# EAGLE design krajBB-Mojžiš_MatejFIN2 (EAGLE 7.7.0)
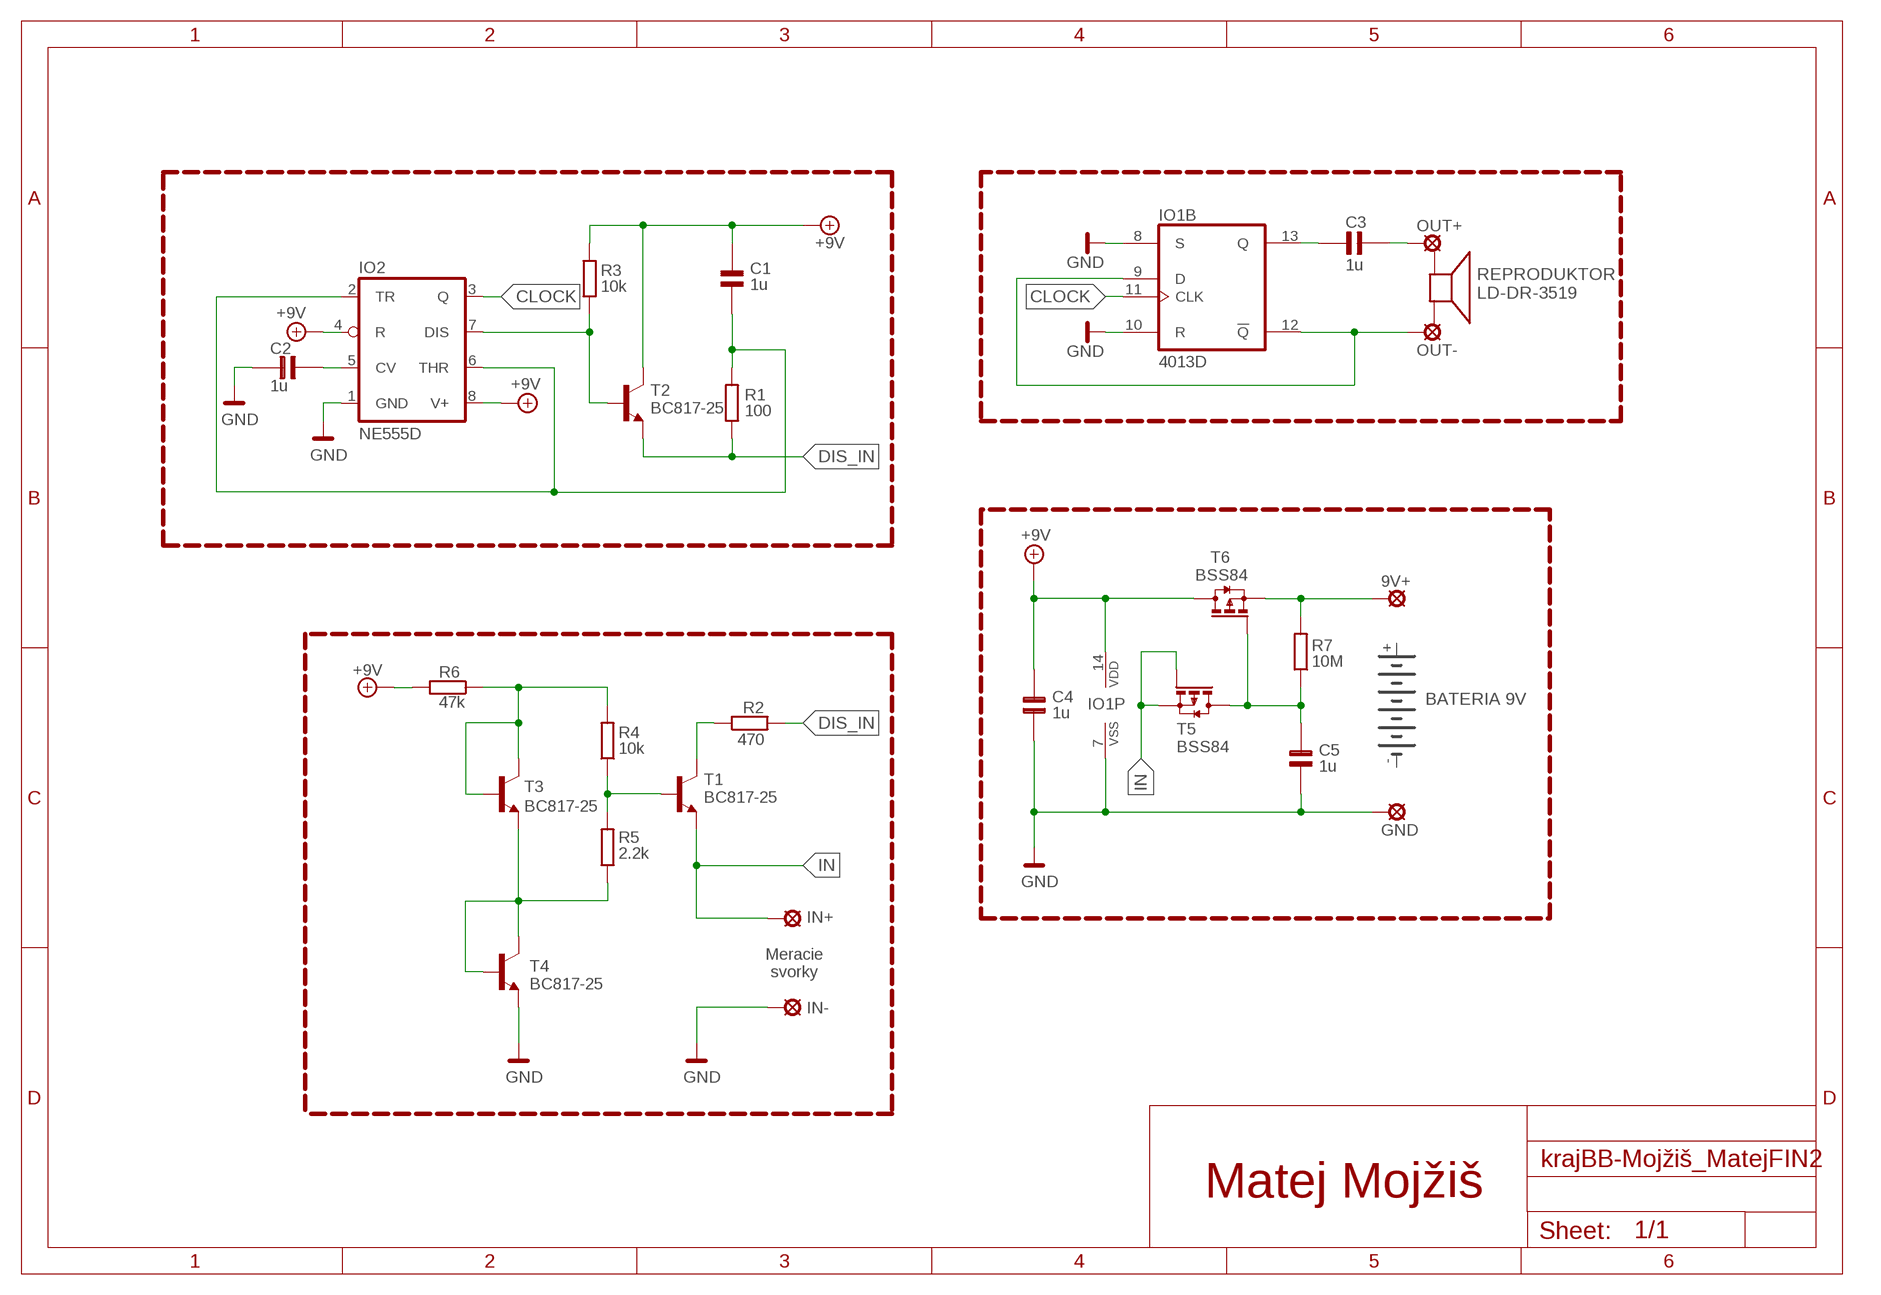
[diagram p0: schematic, sheet 1]

## Parts
9V+  SMD3X3  [SMD3X3]
C1  1u  C1206TOP  [1206]
C2  1u  C1206TOP  [1206]
C3  1u  C1206TOP  [1206]
C4  1u  C1206TOP  [1206]
C5  1u  C1206TOP  [1206]
GND  SMD3X3  [SMD3X3]
IN+  SMD3X3  [SMD3X3]
IN-  SMD3X3  [SMD3X3]
IO1  4013D  [SO14]
IO2  NE555D  [SO08]
OUT+  SMD3X3  [SMD3X3]
OUT-  SMD3X3  [SMD3X3]
R1  100  R1206TOP  [1206]
R2  470  R1206TOP  [1206]
R3  10k  R1206TOP  [1206]
R4  10k  R1206TOP  [1206]
R5  2.2k  R1206TOP  [1206]
R6  47k  R1206TOP  [1206]
R7  10M  R1206TOP  [1206]
REPRODUKTOR  LD-DR-3519  [LD-DR-3519]
T1  BC817-25  BC817-25SMD  [SOT23-BEC]
T2  BC817-25  BC817-25SMD  [SOT23-BEC]
T3  BC817-25  BC817-25SMD  [SOT23-BEC]
T4  BC817-25  BC817-25SMD  [SOT23-BEC]
T5  BSS84  [SOT23]
T6  BSS84  [SOT23]
U$1  9VBATTERY  [9VBATTERY]

## Nets
9V_1: R4.2 R6.1 T3.B T3.C
9V_2: R5.1 T3.E T4.B T4.C
+9V: C1.2 C4.2 IO1.14(P:VDD) IO2.4(R) IO2.8(V+) R3.2 R6.2 T2.C T6.3(D)
CLOCK: IO1.11(B:CLK) IO2.3(Q)
CV: C2.2 IO2.5(CV)
DIS: IO2.7(DIS) R3.1 T2.B
DIS_1: R2.1 T1.C
DIS_IN: R1.1 R2.2 T2.E
DIV: R4.1 R5.2 T1.B
GND: C2.1 C4.1 C5.1 GND.P$1(MP) IN-.P$1(MP) IO1.7(P:VSS) IO1.8(B:S) IO1.10(B:R) IO2.1(GND) T4.E
IN: IN+.P$1(MP) T1.E T5.1(G) T5.2(S)
MOS: C5.2 R7.1 T5.3(D) T6.1(G)
OUT: C3.1 IO1.13(B:Q)
REP: C3.2 OUT+.P$1(MP)
REP+: IO1.9(B:D) IO1.12(B:!Q) OUT-.P$1(MP)
THR: C1.1 IO2.2(TR) IO2.6(THR) R1.2
VIN: 9V+.P$1(MP) R7.2 T6.2(S)
Unconnected: IO1.1(A:Q) IO1.2(A:!Q) IO1.3(A:CLK) IO1.4(A:R) IO1.5(A:D) IO1.6(A:S) REPRODUKTOR.P$1 REPRODUKTOR.P$2

## Notes on the sheet
- BATERIA 9V
- Meracie
  svorky
- Matej Mojžiš

## Library data of the parts
9V+ GND IN+ IN- OUT+ OUT- = solpad:SMD3X3
C1-C5 = rcl:C1206: 1206 capacitor, top layer
IO1 = 40xx:4013: Dual D FLIP FLOP, set/reset
IO2 = linear:*555: TIMER
R1-R7 = rcl:R1206: 1206 resistor, top layer
REPRODUKTOR = buzzer:LD-DR-3519
T1-T4 = transistor-npn:BC817*: NPN Transistor
T5 T6 = transistor-small-signal:BSS84: P-CHANNEL MOS FET
U$1 = battery:9VBATTERY: 9V battery symbol and placeholder

## Board
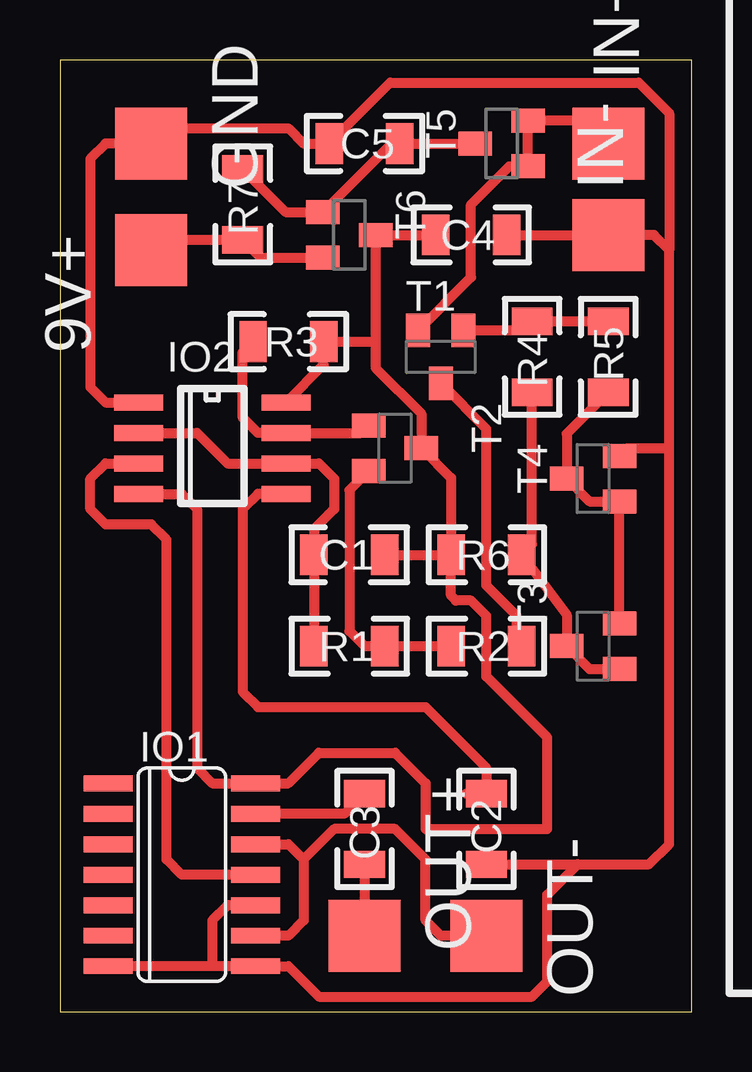
[diagram p1: board, top side]

Size 26.34 x 39.68 mm. Coordinates in mm from the lower left corner, seen from the top.
Outline: 0,0 26.34,0 26.34,39.68 0,39.68 0,0
Copper layers (1*16): Top 0.035mm / dielectric 1.5mm / Bottom 0.035mm
Design rules "default *": minimum track width 10mil, minimum drill 24mil, track to track 8mil, track to pad 8mil, pad to pad 8mil, via to via 8mil, smd to smd 8mil, copper to edge 16mil, drill to drill 8mil, minimum pad ring 10mil, minimum via ring 8mil, stop-mask expansion 4mil, vias tented up to drill 0mil, thermal gap 10mil

### Footprints (pad centres in the part's own frame; a part is rotated, then mirrored left to right if it is on the bottom)
SMD3X3 = smd 3 x 3: P$1 0,0
1206 = smd 1.143 x 1.702: 1 -1.473,0; 2 1.473,0
SO14 = smd 0.66 x 2.032: 1 -3.81,-3.073; 2 -2.54,-3.073; 3 -1.27,-3.073; 4 0,-3.073; 5 1.27,-3.073; 6 2.54,-3.073; 7 3.81,-3.073; 8 3.81,3.073; 9 2.54,3.073; 10 1.27,3.073; 11 0,3.073; 12 -1.27,3.073; 13 -2.54,3.073; 14 -3.81,3.073
SO08 = smd 0.66 x 2.032: 1 -1.905,-3.073; 2 -0.635,-3.073; 3 0.635,-3.073; 4 1.905,-3.073; 5 1.905,3.073; 6 0.635,3.073; 7 -0.635,3.073; 8 -1.905,3.073
LD-DR-3519 = drill 1 pad 1.93 long: P$1 -3,-15; P$2 3,-15
SOT23-BEC = smd 1 x 1.4: B -0.95,-1.1; C 0,1.1; E 0.95,-1.1
SOT23 = smd 1 x 1.4: 1 -0.95,-1.1; 2 0.95,-1.1; 3 0,1.1

### Placement (x,y rotation side)
9V+  3.81,31.75 270 top
C1  12.06,19.05 0 top
C2  17.78,7.62 90 top
C3  12.7,7.62 270 top
C4  17.14,32.38 180 top
C5  12.7,36.2 0 top
GND  3.81,36.2 90 top
IN+  22.86,36.2 270 top
IN-  22.86,32.38 90 top
IO1  5.08,5.71 270 top
IO2  6.35,23.5 270 top
OUT+  12.7,3.17 90 top
OUT-  17.78,3.17 90 top
R1  12.06,15.24 180 top
R2  17.78,15.24 180 top
R3  9.53,27.94 0 top
R4  19.68,27.31 270 top
R5  22.86,27.31 90 top
R6  17.78,19.05 180 top
R7  7.62,33.66 270 top
REPRODUKTOR  73.03,24.13 0 top  (outside the outline)
T1  15.88,27.31 180 top
T2  13.97,23.5 270 top
T3  22.23,15.24 90 top
T4  22.23,22.23 90 top
T5  18.41,36.2 90 top
T6  12.06,32.38 270 top
U$1  41.91,24.77 0 top  (outside the outline)

### Tracks (layer width: path | path; a pad name or v marks a point on that pad's centre or on a via)
9V_1
  Top 0.406: R4.2 19.68,19.48 R6.1 21.12,16.54 T3.C 22.07,14.29 T3.B
9V_2
  Top 0.406: R5.1 21.12,24.1 T4.C 22.07,21.28 T4.B T3.E
+9V
  Top 0.406: C4.2 T6.3 13.16,27.94 | IO2.4 5.08,21.59 5.71,20.96 5.71,10.16 6.35,9.53 IO1.14 9.53,9.53 10.79,10.79 13.97,10.79 15.24,9.53 15.24,7.62 20.32,7.62 20.32,11.43 17.78,13.97 17.78,16.51 17.14,17.15 16.51,17.15 16.31,17.35 R6.2 | R6.2 16.31,22.26 T2.C 15.07,24.94 13.16,26.84 13.16,27.94 | C1.2 R6.2 | 16.31,18.62 R6.2 | IO2.8 11,26.98 R3.2 13.16,27.94
CLOCK
  Top 0.406: IO1.11 5.08,5.71 4.45,6.35 4.45,19.69 3.81,20.32 1.91,20.32 1.27,20.96 1.27,22.23 1.91,22.86 IO2.3
CV
  Top 0.406: IO2.5 8.26,21.59 7.62,20.96 7.62,13.33 8.26,12.7 15.24,12.7 17.78,10.16 C2.2 16.94,9.09
DIS
  Top 0.406: T2.B 12.55,24.13 IO2.7 8.26,24.13 7.62,24.77 7.62,27.51 R3.1
DIS_1
  Top 0.406: T1.C 17.78,24.3 17.78,17.78 19.05,16.51 19.05,15.24 R2.1
DIS_IN
  Top 0.406: T2.E 12.06,21.74 12.06,15.88 12.7,15.24 R1.1 R2.2
DIV
  Top 0.406: R5.2 R4.1 19.31,28.41 T1.B
GND
  Top 0.406: 6.35,1.91 IO1.7 | IO1.10 6.99,4.45 6.35,3.81 6.35,1.91 | C4.1 IN-.P$1 24.77,32.38 25.4,31.75 | C2.1 21.59,6.15 | 21.59,6.15 24.56,6.15 25.4,6.98 25.4,23.5 | 25.4,23.5 25.4,31.75 | T4.E 23.64,23.5 25.4,23.5 | 21.59,6.15 20.32,4.88 20.32,1.27 19.68,0.64 10.79,0.64 9.53,1.91 IO1.8 6.35,1.91 | 25.4,31.75 25.4,37.46 24.13,38.73 13.77,38.73 C5.1 10.16,36.2 9.53,36.83 4.45,36.83 GND.P$1 1.91,36.2 1.27,35.56 1.27,26.04 1.91,25.4 IO2.1
IN
  Top 0.406: IN+.P$1 21.91,37.14 T5.2 T5.1 18.73,35.24 17.14,33.66 17.14,30.62 T1.E
MOS
  Top 0.406: T5.3 C5.2 13.82,36.2 T6.1 9.41,33.34 R7.1
OUT
  Top 0.406: C3.1 11.86,8.26 IO1.13
REP
  Top 0.406: C3.2 OUT+.P$1
REP+
  Top 0.406: IO1.12 9.53,6.98 10.16,6.35 | 10.16,6.35 10.16,3.81 9.53,3.17 IO1.9 | OUT-.P$1 15.88,3.17 15.24,3.81 15.24,6.35 13.97,7.62 11.43,7.62 10.16,6.35
THR
  Top 0.406: R1.2 C1.1 10.59,20.12 11.43,20.96 11.43,22.23 10.79,22.86 IO2.6 6.99,22.86 5.71,24.13 IO2.2
VIN
  Top 0.406: T6.2 8.37,31.44 R7.2 4.24,32.18 9V+.P$1